# Altium schematic sheet Memory Address Register.SchDoc
size A; Author: E. Sims; Organization: Let's Build Rockets Inc.; SheetNumber: 2; SheetTotal: 11
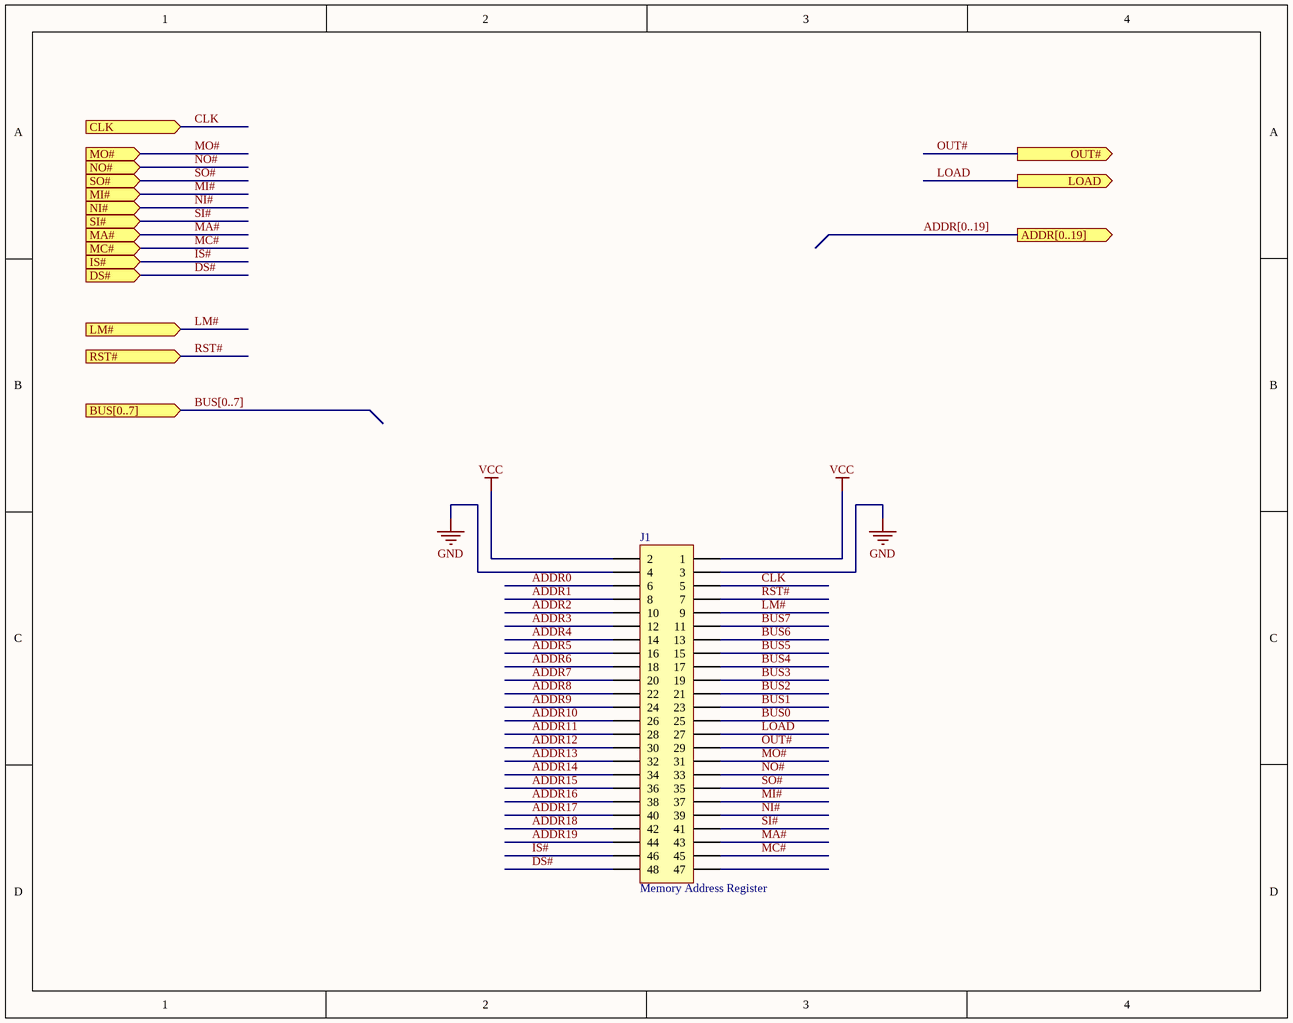
[diagram p0: Memory Address Register.SchDoc]

## Parts
J1  Memory Address Register  [HDR2X24]

## Ports
ADDR[0..19] (out), BUS[0..7] (in), CLK (in), DS# (in), IS# (in), LM# (in), LOAD (out), MA# (in), MC# (in), MI# (in), MO# (in), NI# (in), NO# (in), OUT# (out), RST# (in), SI# (in), SO# (in)

## Nets
GND: J1.3 J1.4
VCC: J1.1 J1.2
ADDR0: J1.6
ADDR1: J1.8
ADDR2: J1.10
ADDR3: J1.12
ADDR4: J1.14
ADDR5: J1.16
ADDR6: J1.18
ADDR7: J1.20
ADDR8: J1.22
ADDR9: J1.24
ADDR10: J1.26
ADDR11: J1.28
ADDR12: J1.30
ADDR13: J1.32
ADDR14: J1.34
ADDR15: J1.36
ADDR16: J1.38
ADDR17: J1.40
ADDR18: J1.42
ADDR19: J1.44
BUS0: J1.25
BUS1: J1.23
BUS2: J1.21
BUS3: J1.19
BUS4: J1.17
BUS5: J1.15
BUS6: J1.13
BUS7: J1.11
CLK: J1.5 ; port CLK
DS#: J1.48 ; port DS#
IS#: J1.46 ; port IS#
LM#: J1.9 ; port LM#
LOAD: J1.27 ; port LOAD
MA#: J1.43 ; port MA#
MC#: J1.45 ; port MC#
MI#: J1.37 ; port MI#
MO#: J1.31 ; port MO#
NI#: J1.39 ; port NI#
NO#: J1.33 ; port NO#
OUT#: J1.29 ; port OUT#
RST#: J1.7 ; port RST#
SI#: J1.41 ; port SI#
SO#: J1.35 ; port SO#

Not connected (* = marked no-connect by the designer): J1 47

## Buses and harness runs
bus ADDR[0..19] = port ADDR[0..19]
bus BUS[0..7] = port BUS[0..7]

## Notes on the sheet
- Let's Build Rocket's Inc. Modular Paylaod System Based on TMP-010 Rev
  For more information visit https://github.com/LetsBuildRockets/Modular-Payload-System
  This work is licensed under CC BY-NC 4.0. To view a copy of this license, visit https://creativecommons.org/licenses/by-nc/4.0
- Title
- Size:
- Date:
- Assembly Variant:
- B
- Number:
- Time:
- Revision:
- Sheet
- of
- Author:
- File:

## Library data of the parts
J1 = Header 24x2: Header, 24-Pin, Dual row; System: Connector; LatestRevisionDate: 17-Jul-2002; LatestRevisionNote: Re-released for DXP Platform.; Publisher: Altium Limited